# EAGLE schematic relays-board (EAGLE 9.2.2)
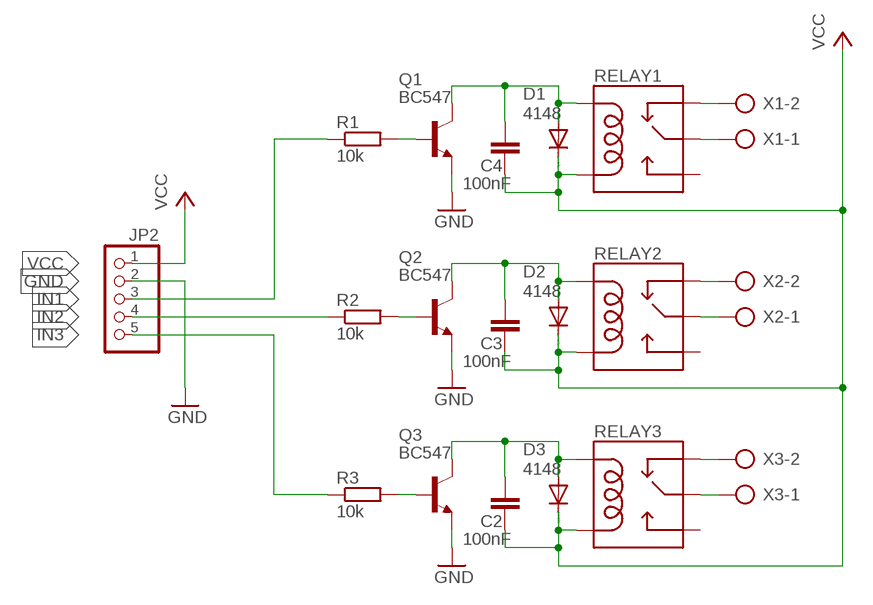
[diagram p0: schematic, sheet 1]

## Parts
C2  100nF  C-EU025-025X050  [C025-025X050]
C3  100nF  C-EU025-025X050  [C025-025X050]
C4  100nF  C-EU025-025X050  [C025-025X050]
D1  4148  1N4148DO35-10  [DO35-10]
D2  4148  1N4148DO35-10  [DO35-10]
D3  4148  1N4148DO35-10  [DO35-10]
JP2  PINHD-1X5  [1X05]
Q1  BC547  [TO92]
Q2  BC547  [TO92]
Q3  BC547  [TO92]
R1  10k  R-EU_0207/10  [0207/10]
R2  10k  R-EU_0207/10  [0207/10]
R3  10k  R-EU_0207/10  [0207/10]
RELAY1  RELAYPTH  [SRD-05VDC-SL-C]
RELAY2  RELAYPTH  [SRD-05VDC-SL-C]
RELAY3  RELAYPTH  [SRD-05VDC-SL-C]
X1  AK300/2  [AK300/2]
X2  AK300/2  [AK300/2]
X3  AK300/2  [AK300/2]

## Nets
GND: JP2.2 Q1.1(E) Q2.1(E) Q3.1(E)
IN1: JP2.3 R1.1
IN2: JP2.4 R2.1
IN3: JP2.5 R3.1
N$7: RELAY3.SWCOMMON X3.1
N$8: RELAY3.SWCLOSED(SWCLOSE) X3.2
N$12: Q1.2(B) R1.2
N$13: RELAY2.SWCLOSED(SWCLOSE) X2.2
N$14: RELAY2.SWCOMMON X2.1
N$15: RELAY1.SWCOMMON X1.1
N$16: RELAY1.SWCLOSED(SWCLOSE) X1.2
N$17: C2.1 D3.A Q3.3(C) RELAY3.COIL1
N$18: C3.1 D2.A Q2.3(C) RELAY2.COIL1
N$19: C4.1 D1.A Q1.3(C) RELAY1.COIL1
N$22: Q2.2(B) R2.2
N$23: Q3.2(B) R3.2
VCC: C2.2 C3.2 C4.2 D1.C D2.C D3.C JP2.1 RELAY1.COIL0 RELAY2.COIL0 RELAY3.COIL0
Unconnected: RELAY1.SWOPEN RELAY2.SWOPEN RELAY3.SWOPEN

## Library data of the parts
C2-C4 = rcl:C-EU: CAPACITOR, European symbol
D1-D3 = diode:1N4148: DIODE high speed (Philips)
JP2 = pinhead:PINHD-1X5: PIN HEADER
Q1-Q3 = transistor-npn:BC547*: NPN Transistor
R1-R3 = rcl:R-EU_: RESISTOR, European symbol
RELAY1-RELAY3 = SRD-05VDC-SL-C:RELAY: SPDT relay (COM-00101)
X1-X3 = con-ptr500:AK300/2: CONNECTOR; OC_FARNELL: unknown; OC_NEWARK: unknown